# Altium schematic sheet R3P900.SchDoc
size A4
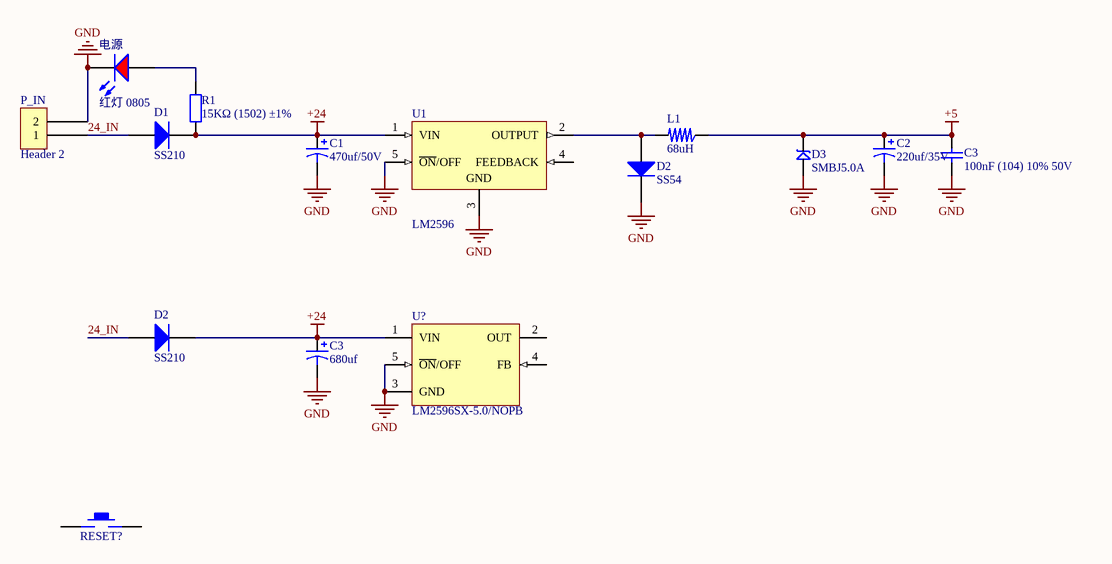
[diagram p0: R3P900.SchDoc]

## Parts
(Parts that share a designator on the sheet are numbered #1, #2 ... from top to bottom, then left to right.)
C1  470uf/50V  [Cap_5.0]
C2  220uf/35V  [CAP_3.5]
C3#1  100nF (104) 10% 50V  [LC-0603_C]
C3#2  680uf  [Cap_5.0]
D1  SS210  [LC-SMA(DO-214AC)_S1]
D2#1  SS54  [LC-SMA(DO-214AC)_S1]
D2#2  SS210  [LC-SMA(DO-214AC)_S1]
D3  SMBJ5.0A  [SMBJ]
L1  68uH  [L_SOP74]
P_IN  Header 2  [VH-2A]
R1  15KΩ (1502) ±1%  [LC-0805_R]
RESET?  KEY_M  [KEY_M]  (value not drawn)
U1  LM2596  [LC-TO-220-5]
U?  LM2596SX-5.0/NOPB  [LC-TO-263-5]
电源  红灯 0805  [0805_LED_S1]

## Nets
+5: C2.1 C3#1.2 D3.2 L1.1
+24: C1.1 C3#2.1 D1.2(K) D2#2.2(K) R1.1 U1.1(VIN) U?.1(VIN)
GND: C1.2 C2.2 C3#1.1 C3#2.2 D2#1.2(K) D3.1 P_IN.2 U1.3(GND) U1.5(~{ON}/OFF) U?.3(GND) U?.5(~{ON}/OFF) 电源.K
24_IN: D1.1(A) D2#2.1(A) P_IN.1
NetD2#1_1: D2#1.1(A) L1.2 U1.2(OUTPUT)
NetR1_2: R1.2 电源.A

Not connected (* = marked no-connect by the designer): RESET? 1 2; U1 4(FEEDBACK); U? 2(OUT) 4(FB)

## Library data of the parts
C1 C2 C3#2 = Cap_DIP
C3#1 = 0603 100nF (104) 10% 50V: 贴片电容; ComponentLink1Description: 供应商链接; ComponentLink1URL: http://www.szlcsc.com/product/details_15331.html; Package: 0603; Supplier: LC; SuppliersPartNumber: C14663
D1 D2#2 = SMA(DO-214AC) SS210: 二极管; ComponentLink1Description: 供应商链接; ComponentLink1URL: http://www.szlcsc.com/product/details_15669.html; Package: SMA(DO-214AC); Supplier: LC; SuppliersPartNumber: C14996
D2#1 = SMA(DO-214AC) SS54: 二极管; ComponentLink1Description: 供应商链接; ComponentLink1URL: http://www.szlcsc.com/product/details_23178.html; Package: SMA(DO-214AC); Supplier: LC; SuppliersPartNumber: C22452
D3 = SMBJ: TVS
L1 = L_SOP
P_IN = Header 2: 贴片2p座
R1 = 0805 15KΩ (1502) 1%: 贴片电阻; ComponentLink1Description: 供应商链接; ComponentLink1URL: http://www.szlcsc.com/product/details_18163.html; Package: 0805; Supplier: LC; SuppliersPartNumber: C17475
U1 = LM2596: Power Chip
U? = LM2596SX-5.0/NOPB: DC-DC芯片; ComponentLink1Description: 供应商链接; ComponentLink1URL: http://www.szlcsc.com/product/details_10538.html; Package: TO-263-5; Supplier: LC; SuppliersPartNumber: C10002
电源 = 0805 红灯: 发光二极管; ComponentLink1Description: 供应商链接; ComponentLink1URL: http://www.szlcsc.com/product/details_2668.html; Package: 0805; Supplier: LC; SuppliersPartNumber: C2295